# Altium schematic sheet ETH1G_MAGNET_RJ45MIDMNT.SchDoc
size A3; SheetNumber: 5; SheetTotal: 22
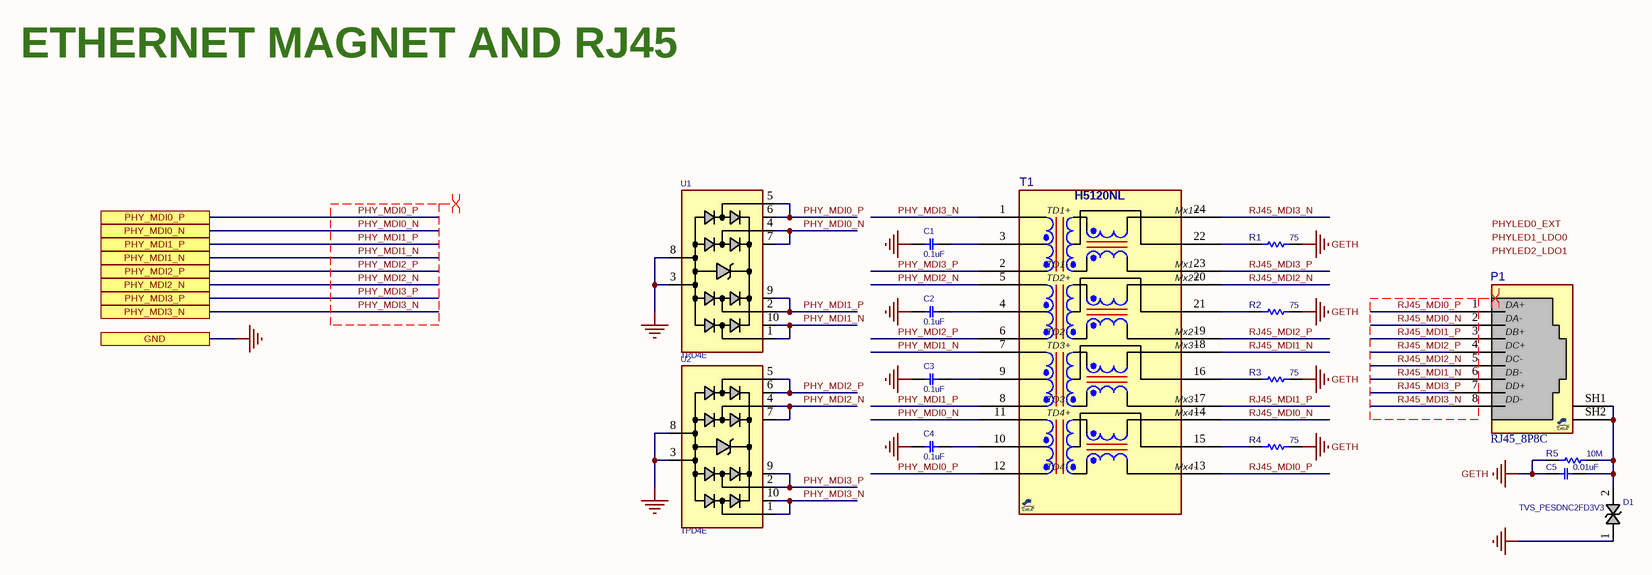
[diagram p0: ETH1G_MAGNET_RJ45MIDMNT.SchDoc]

## Parts
C1  0.1uF  [C0402]
C2  0.1uF  [C0402]
C3  0.1uF  [C0402]
C4  0.1uF  [C0402]
C5  0.01uF  [C1210]
D1  TVS_PESDNC2FD3V3  [ESD0402]
P1  RJ45_8P8C  [RJ45_8S_RA_TD_SMD]
R1  75  [R0402]
R2  75  [R0402]
R3  75  [R0402]
R4  75  [R0402]
R5  10M  [R1206]
T1  H5120NL  [SO_24_9W2H]  (value not drawn)
U1  TPD4E  [SON50_10_2510]
U2  TPD4E  [SON50_10_2510]

## Ports
GND, PHY_MDI0_N, PHY_MDI0_P, PHY_MDI1_N, PHY_MDI1_P, PHY_MDI2_N, PHY_MDI2_P, PHY_MDI3_N, PHY_MDI3_P

## Nets
GETH: C5.1 R1.1 R2.1 R3.1 R4.1 R5.2
GND: C1.1 C2.1 C3.1 C4.1 D1.1 U1.3 U1.8 U2.3 U2.8 ; port GND
PHY_MDI0_N: T1.11(TD4+) U1.4 U1.7 ; port PHY_MDI0_N
PHY_MDI0_P: T1.12(TD4-) U1.5 U1.6 ; port PHY_MDI0_P
PHY_MDI1_N: T1.7(TD3+) U1.1 U1.10 ; port PHY_MDI1_N
PHY_MDI1_P: T1.8(TD3-) U1.2 U1.9 ; port PHY_MDI1_P
PHY_MDI2_N: T1.5(TD2+) U2.4 U2.7 ; port PHY_MDI2_N
PHY_MDI2_P: T1.6(TD2-) U2.5 U2.6 ; port PHY_MDI2_P
PHY_MDI3_N: T1.1(TD1+) U2.1 U2.10 ; port PHY_MDI3_N
PHY_MDI3_P: T1.2(TD1-) U2.2 U2.9 ; port PHY_MDI3_P
RJ45_MDI0_N: P1.2(DA-) T1.14(MX4+)
RJ45_MDI0_P: P1.1(DA+) T1.13(MX4-)
RJ45_MDI1_N: P1.6(DB-) T1.18(MX3+)
RJ45_MDI1_P: P1.3(DB+) T1.17(MX3-)
RJ45_MDI2_N: P1.5(DC-) T1.20(MX2+)
RJ45_MDI2_P: P1.4(DC+) T1.19(MX2-)
RJ45_MDI3_N: P1.8(DD-) T1.24(MX1+)
RJ45_MDI3_P: P1.7(DD+) T1.23(MX1-)
NetC1_2: C1.2 T1.3(TCT1)
NetC2_2: C2.2 T1.4(TCT2)
NetC3_2: C3.2 T1.9(TCT3)
NetC4_2: C4.2 T1.10(TCT4)
NetC5_2: C5.2 D1.2 P1.SH1 P1.SH2 R5.1
NetR1_2: R1.2 T1.22(MCT1)
NetR2_2: R2.2 T1.21(MCT2)
NetR3_2: R3.2 T1.16(MCT3)
NetR4_2: R4.2 T1.15(MCT4)

## Layout directives
differential pair: PHY_MDI0_N, PHY_MDI0_P, PHY_MDI1_N, PHY_MDI1_P, PHY_MDI2_N, PHY_MDI2_P, PHY_MDI3_N, PHY_MDI3_P, RJ45_MDI0_N, RJ45_MDI0_P, RJ45_MDI1_N, RJ45_MDI1_P, RJ45_MDI2_N, RJ45_MDI2_P, RJ45_MDI3_N, RJ45_MDI3_P

## Notes on the sheet
- ETHERNET MAGNET AND RJ45
- Labels drawn without touching a wire or pin: PHYLED0_EXT, PHYLED1_LDO0, PHYLED2_LDO1
- (in symbol H5120NL_SO24) Mx1+; Mx1-; Mx2+; Mx2-; Mx3+; Mx3-; Mx4+; Mx4-

## Library data of the parts
C1-C4 = CAP_SMD_MLCC_100n50T: CAP, MLCC; PARAM: X5R, 10%; MANF_P#: GRM155R61E104; MANF: Murata; PARAM2: 25v; ASSEMBLY: ASSEMBLY; PRICE: 10,000:$0.006; VALUE: 0.1uF
C5 = CAP_SMD_MLCC_100n50T: CAP, MLCC; PARAM2: 2kv; PARAM: -; MANF_P#: -; MANF: -; ASSEMBLY: ASSEMBLY; PRICE: -; VALUE: 0.01uF
D1 = TVS_PESDNC2FD3V3: TVS, ESD PROTECT, Bidirectional; MANF_P#: PESDNC2FD3V3BS; PARAM2: 3.3vb, 10.5vr; MANF: -; PRICE: 0.7$; VALUE: TVS_PESDNC2FD3V3
P1 = RJ45_8S_RA_TD_SMD: RJ45, 8P, SHIELDED, RightAngle, TabDown, SMDEMI panel ground; MANF: Heling; MANF_P#: MJ88-B011-JRVS1-P; PRICE: 1.2$; VALUE: RJ45_8P8C
R1-R5 = RES_SMD: RESISTOR, SMD; PARAM: 0.063W; DESC: DESCRIPTION; DIST#: MOUSER; PARAM2: 1%; MANF: -; ASSEMBLY: ASSEMBLY; PRICE: 100= 0.3$; MANF_P#: -
  R1-R4: VALUE: 75
  R5: VALUE: 10M
T1 = H5120NL_SO24: Transformer, LAN, 1000 Base-T, 1CT:1CT, 350uH; MANF: Pulse, link-pp; MANF_P#: H5120NL, LP82453NL; PARAM2: 1CT:1CT, 350uH, -40~85°C; MANF_P#2: LP82453NL Link-pp; PARAM: LAN, 1000 Base-T; PRICE: 9$; VALUE: H5120NL
U1 U2 = TVS_X4_TPD4E05U06: TVS, ESD PROTECT, 4CH,; MANF_P#: TPD4E05U06DQA; MANF: Texas Instruments; PARAM2: 6.5Vbr, 0.4pF, –40°~125°C; PARAM: ±12-kV ContactD, ±15-kVAirD; PRICE: 0.6$; VALUE: TPD4E